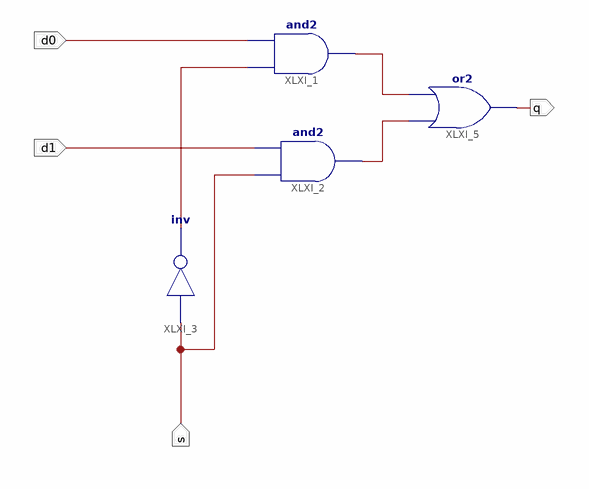
[diagram p0: schematic sheet 1]
// Xilinx ISE schematic MUX_2_to_1.sch (spartan3e) as structural Verilog: 4 symbols, 4 ports
module MUX_2_to_1 (
  input  d0,
  input  d1,
  input  s,
  output q
);

  wire XLXN_4, XLXN_10, XLXN_11;

  and XLXI_2 (XLXN_11, s, d1);
  not XLXI_3 (XLXN_4, s);
  and XLXI_1 (XLXN_10, XLXN_4, d0);
  or XLXI_5 (q, XLXN_11, XLXN_10);
endmodule
